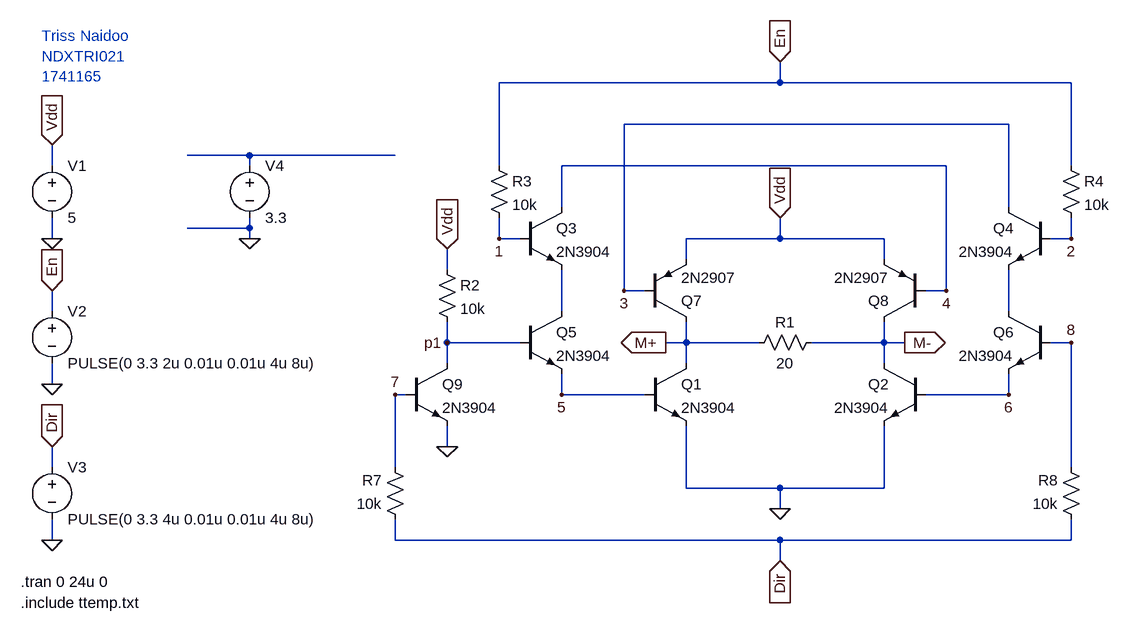
[diagram p0: schematic EEE3088F_BJT_Driver_Simulation.asc]
EEE3088F_BJT_Driver_Simulation.asc, the LTspice schematic file:
Version 4
SHEET 1 2324 680
WIRE 400 -352 400 -384
WIRE 400 -352 -32 -352
WIRE 848 -352 400 -352
WIRE 752 -288 160 -288
WIRE -416 -240 -512 -240
WIRE -192 -240 -416 -240
WIRE -720 -224 -720 -256
WIRE -416 -224 -416 -240
WIRE -32 -224 -32 -352
WIRE 656 -224 64 -224
WIRE 848 -224 848 -352
WIRE 64 -160 64 -224
WIRE 752 -160 752 -288
WIRE -416 -128 -416 -144
WIRE -416 -128 -512 -128
WIRE -720 -112 -720 -144
WIRE -416 -112 -416 -128
WIRE -32 -112 -32 -144
WIRE 0 -112 -32 -112
WIRE 400 -112 400 -144
WIRE 400 -112 256 -112
WIRE 560 -112 400 -112
WIRE 848 -112 848 -144
WIRE 848 -112 816 -112
WIRE 256 -80 256 -112
WIRE 560 -80 560 -112
WIRE -112 -64 -112 -96
WIRE 160 -32 160 -288
WIRE 192 -32 160 -32
WIRE 656 -32 656 -224
WIRE 656 -32 624 -32
WIRE -720 0 -720 -32
WIRE 64 0 64 -64
WIRE 752 0 752 -64
WIRE -112 48 -112 16
WIRE 0 48 -112 48
WIRE 256 48 256 16
WIRE 256 48 224 48
WIRE 368 48 256 48
WIRE 560 48 560 16
WIRE 560 48 448 48
WIRE 592 48 560 48
WIRE 848 48 816 48
WIRE -112 80 -112 48
WIRE 256 80 256 48
WIRE 560 80 560 48
WIRE -720 112 -720 80
WIRE -176 128 -192 128
WIRE 64 128 64 96
WIRE 192 128 64 128
WIRE 752 128 752 96
WIRE 752 128 624 128
WIRE -112 208 -112 176
WIRE -720 240 -720 208
WIRE -192 240 -192 128
WIRE 848 240 848 48
WIRE 256 272 256 176
WIRE 400 272 256 272
WIRE 560 272 560 176
WIRE 560 272 400 272
WIRE 400 304 400 272
WIRE -720 352 -720 320
WIRE -192 352 -192 320
WIRE 400 352 -192 352
WIRE 848 352 848 320
WIRE 848 352 400 352
WIRE 400 384 400 352
FLAG 400 304 0
FLAG 400 -144 Vdd
IOPIN 400 -144 In
FLAG -720 -256 Vdd
IOPIN -720 -256 In
FLAG 400 384 Dir
IOPIN 400 384 In
FLAG 400 -384 En
IOPIN 400 -384 In
FLAG -720 -112 0
FLAG -112 -96 Vdd
IOPIN -112 -96 In
FLAG -720 -32 En
IOPIN -720 -32 In
FLAG -720 208 Dir
IOPIN -720 208 In
FLAG -720 112 0
FLAG -720 352 0
FLAG -112 208 0
FLAG -416 -112 0
FLAG -32 -112 1
FLAG 848 -112 2
FLAG 160 -32 3
FLAG 656 -32 4
FLAG -112 48 p1
FLAG -192 128 7
FLAG 848 48 8
FLAG 64 128 5
FLAG 752 128 6
FLAG 224 48 M+
IOPIN 224 48 Out
FLAG 592 48 M-
IOPIN 592 48 Out
SYMBOL npn 192 80 R0
SYMATTR InstName Q1
SYMATTR Value 2N3904
SYMBOL res 352 64 R270
WINDOW 0 32 56 VTop 2
WINDOW 3 0 56 VBottom 2
SYMATTR InstName R1
SYMATTR Value 20
SYMBOL voltage -720 -240 R0
WINDOW 123 0 0 Left 0
WINDOW 39 0 0 Left 0
SYMATTR InstName V1
SYMATTR Value 5
SYMBOL res -128 -80 R0
SYMATTR InstName R2
SYMATTR Value 10k
SYMBOL res -48 -240 R0
SYMATTR InstName R3
SYMATTR Value 10k
SYMBOL pnp 192 16 M180
SYMATTR InstName Q7
SYMATTR Value 2N2907
SYMBOL pnp 624 16 R180
SYMATTR InstName Q8
SYMATTR Value 2N2907
SYMBOL voltage -720 -16 R0
WINDOW 123 0 0 Left 0
WINDOW 39 0 0 Left 0
SYMATTR InstName V2
SYMATTR Value PULSE(0 3.3 2u 0.01u 0.01u 4u 8u)
SYMBOL voltage -720 224 R0
WINDOW 123 0 0 Left 0
WINDOW 39 0 0 Left 0
SYMATTR InstName V3
SYMATTR Value PULSE(0 3.3 4u 0.01u 0.01u 4u 8u)
SYMBOL voltage -416 -240 R0
WINDOW 123 0 0 Left 0
WINDOW 39 0 0 Left 0
SYMATTR InstName V4
SYMATTR Value 3.3
SYMBOL res -176 336 R180
WINDOW 0 36 76 Left 2
WINDOW 3 36 40 Left 2
SYMATTR InstName R7
SYMATTR Value 10k
SYMBOL res 864 336 R180
WINDOW 0 36 76 Left 2
WINDOW 3 36 40 Left 2
SYMATTR InstName R8
SYMATTR Value 10k
SYMBOL res 832 -240 R0
SYMATTR InstName R4
SYMATTR Value 10k
SYMBOL npn 624 80 M0
SYMATTR InstName Q2
SYMATTR Value 2N3904
SYMBOL npn 0 -160 R0
SYMATTR InstName Q3
SYMATTR Value 2N3904
SYMBOL npn 816 -160 M0
SYMATTR InstName Q4
SYMATTR Value 2N3904
SYMBOL npn 0 0 R0
SYMATTR InstName Q5
SYMATTR Value 2N3904
SYMBOL npn 816 0 M0
SYMATTR InstName Q6
SYMATTR Value 2N3904
SYMBOL npn -176 80 R0
SYMATTR InstName Q9
SYMATTR Value 2N3904
TEXT -768 416 Left 2 !.tran 0 24u 0
TEXT -736 -424 Left 2 ;Triss Naidoo\nNDXTRI021\n1741165
TEXT -768 448 Left 2 !.include ttemp.txt

The netlist it stands for:
* EEE3088F_BJT_Driver_Simulation.asc
Q1 M+ 5 0 0 2N3904
R1 M+ M- 20
V1 Vdd 0 5
R2 Vdd p1 10k
R3 En 1 10k
Q7 M+ 3 Vdd 0 2N2907
Q8 M- 4 Vdd 0 2N2907
V2 En 0 PULSE(0 3.3 2u 0.01u 0.01u 4u 8u)
V3 Dir 0 PULSE(0 3.3 4u 0.01u 0.01u 4u 8u)
V4 N001 0 3.3
R7 Dir 7 10k
R8 Dir 8 10k
R4 En 2 10k
Q2 M- 6 0 0 2N3904
Q3 4 1 N002 0 2N3904
Q4 3 2 N003 0 2N3904
Q5 N002 p1 5 0 2N3904
Q6 N003 8 6 0 2N3904
Q9 p1 7 0 0 2N3904
.model NPN NPN
.model PNP PNP
.lib standard.bjt
.tran 0 24u 0
* Triss Naidoo
* NDXTRI021
* 1741165
.include ttemp.txt
.backanno
.end